# EAGLE schematic io-board-c-2 (EAGLE 8.4.3)
AUTHOR: Balazs Racz; DOCUMENT_NUMBER: none; DRAWING_TITLE: OpenLCB IO Board for Nucleo; LICENSE: [placeholder for license]; REVISION: A; YEAR: 2018
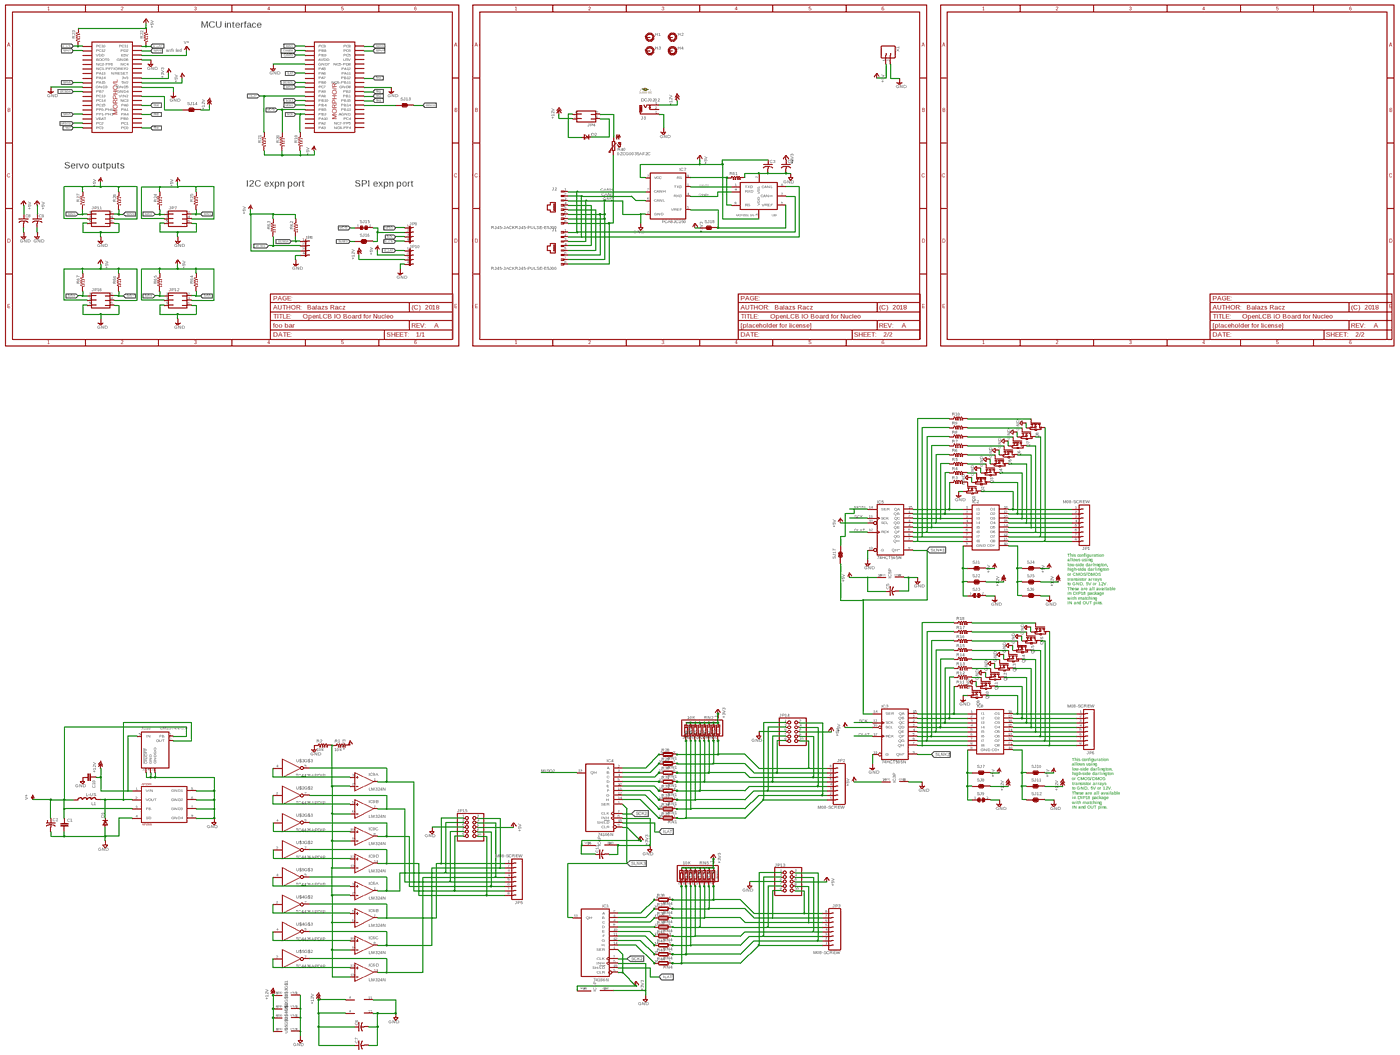
[diagram p0: schematic, sheet 1, overview]
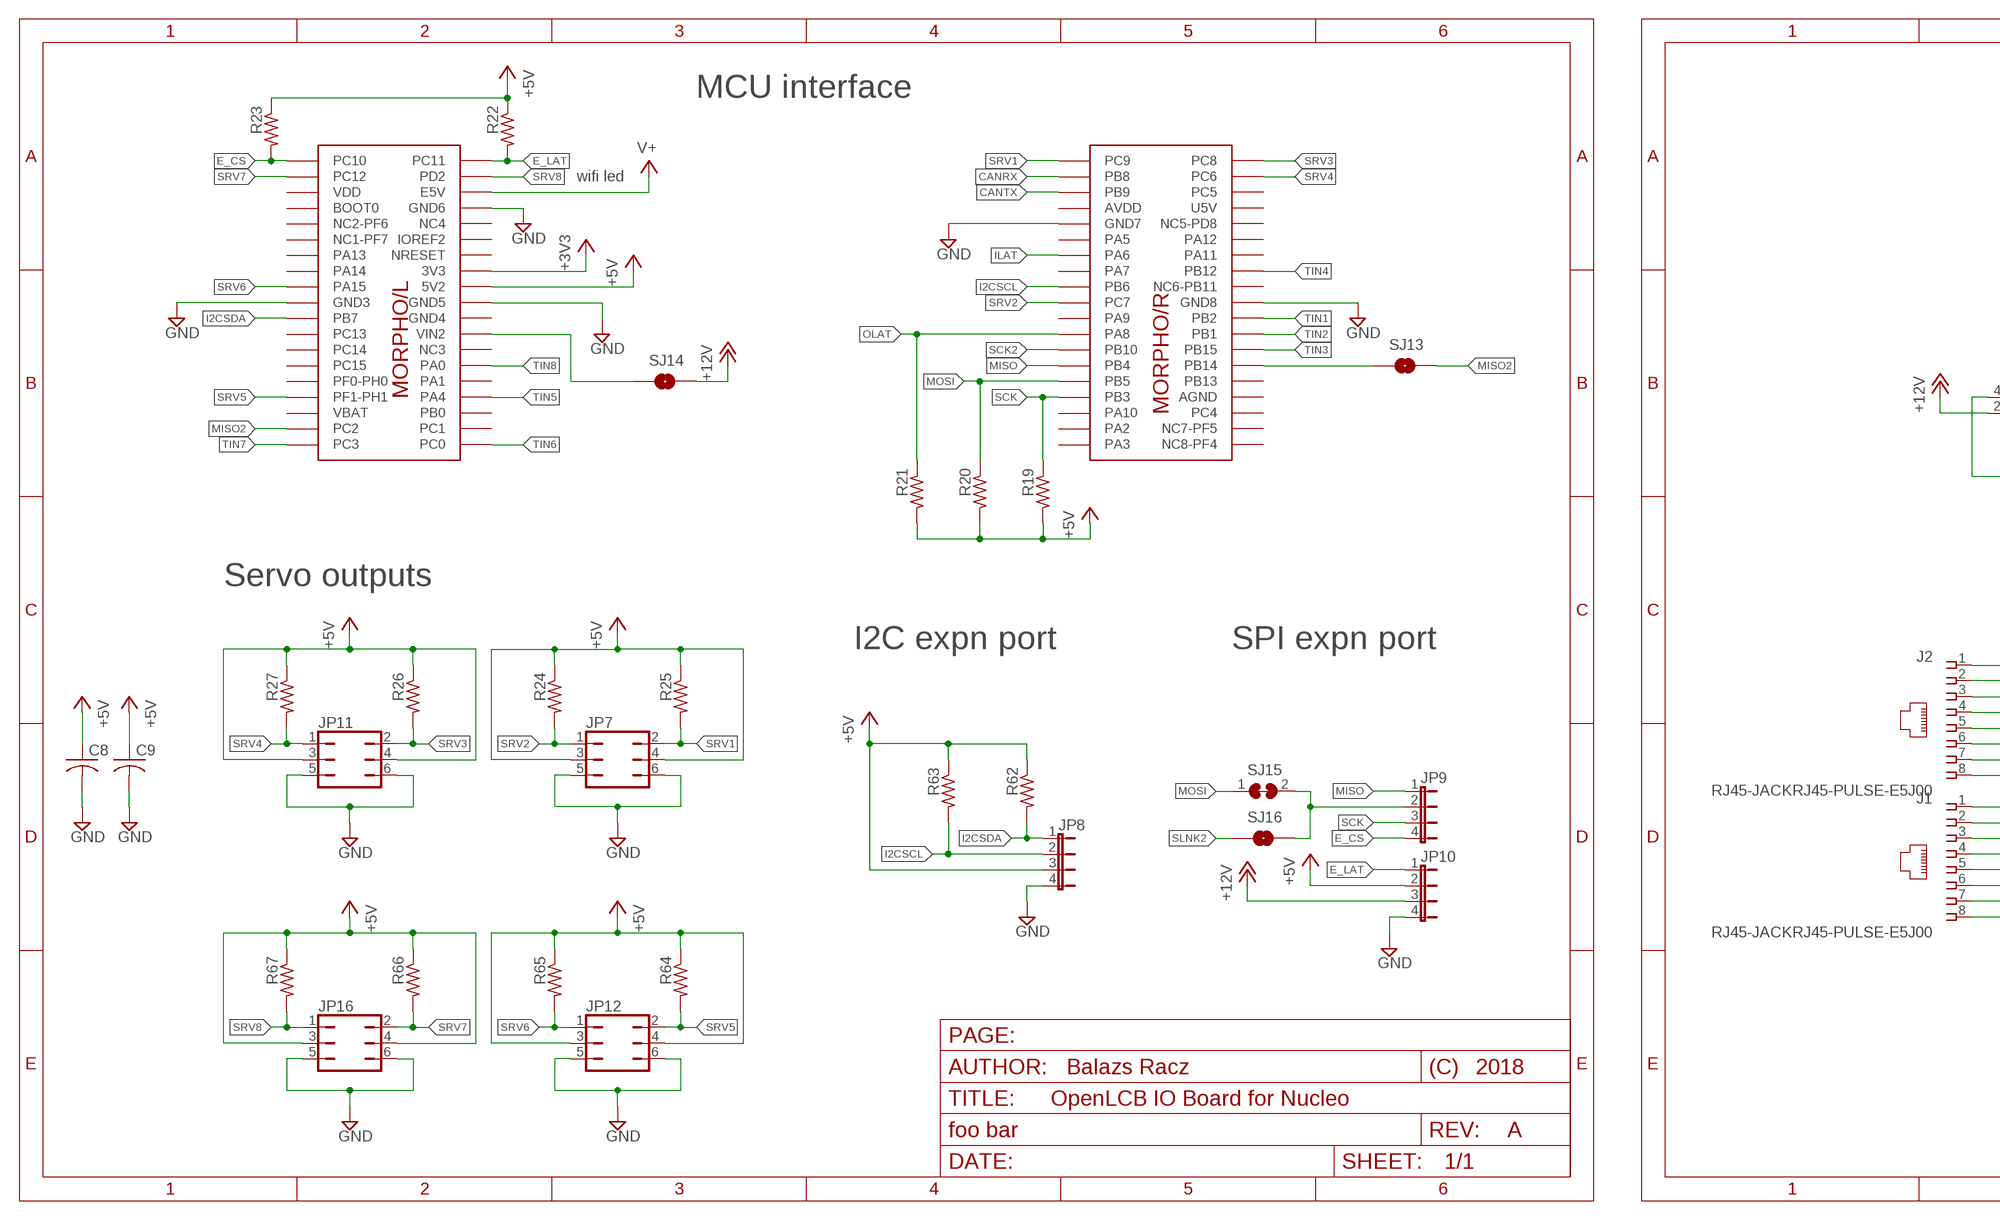
[diagram p1: schematic, sheet 1, part 1 of 4]
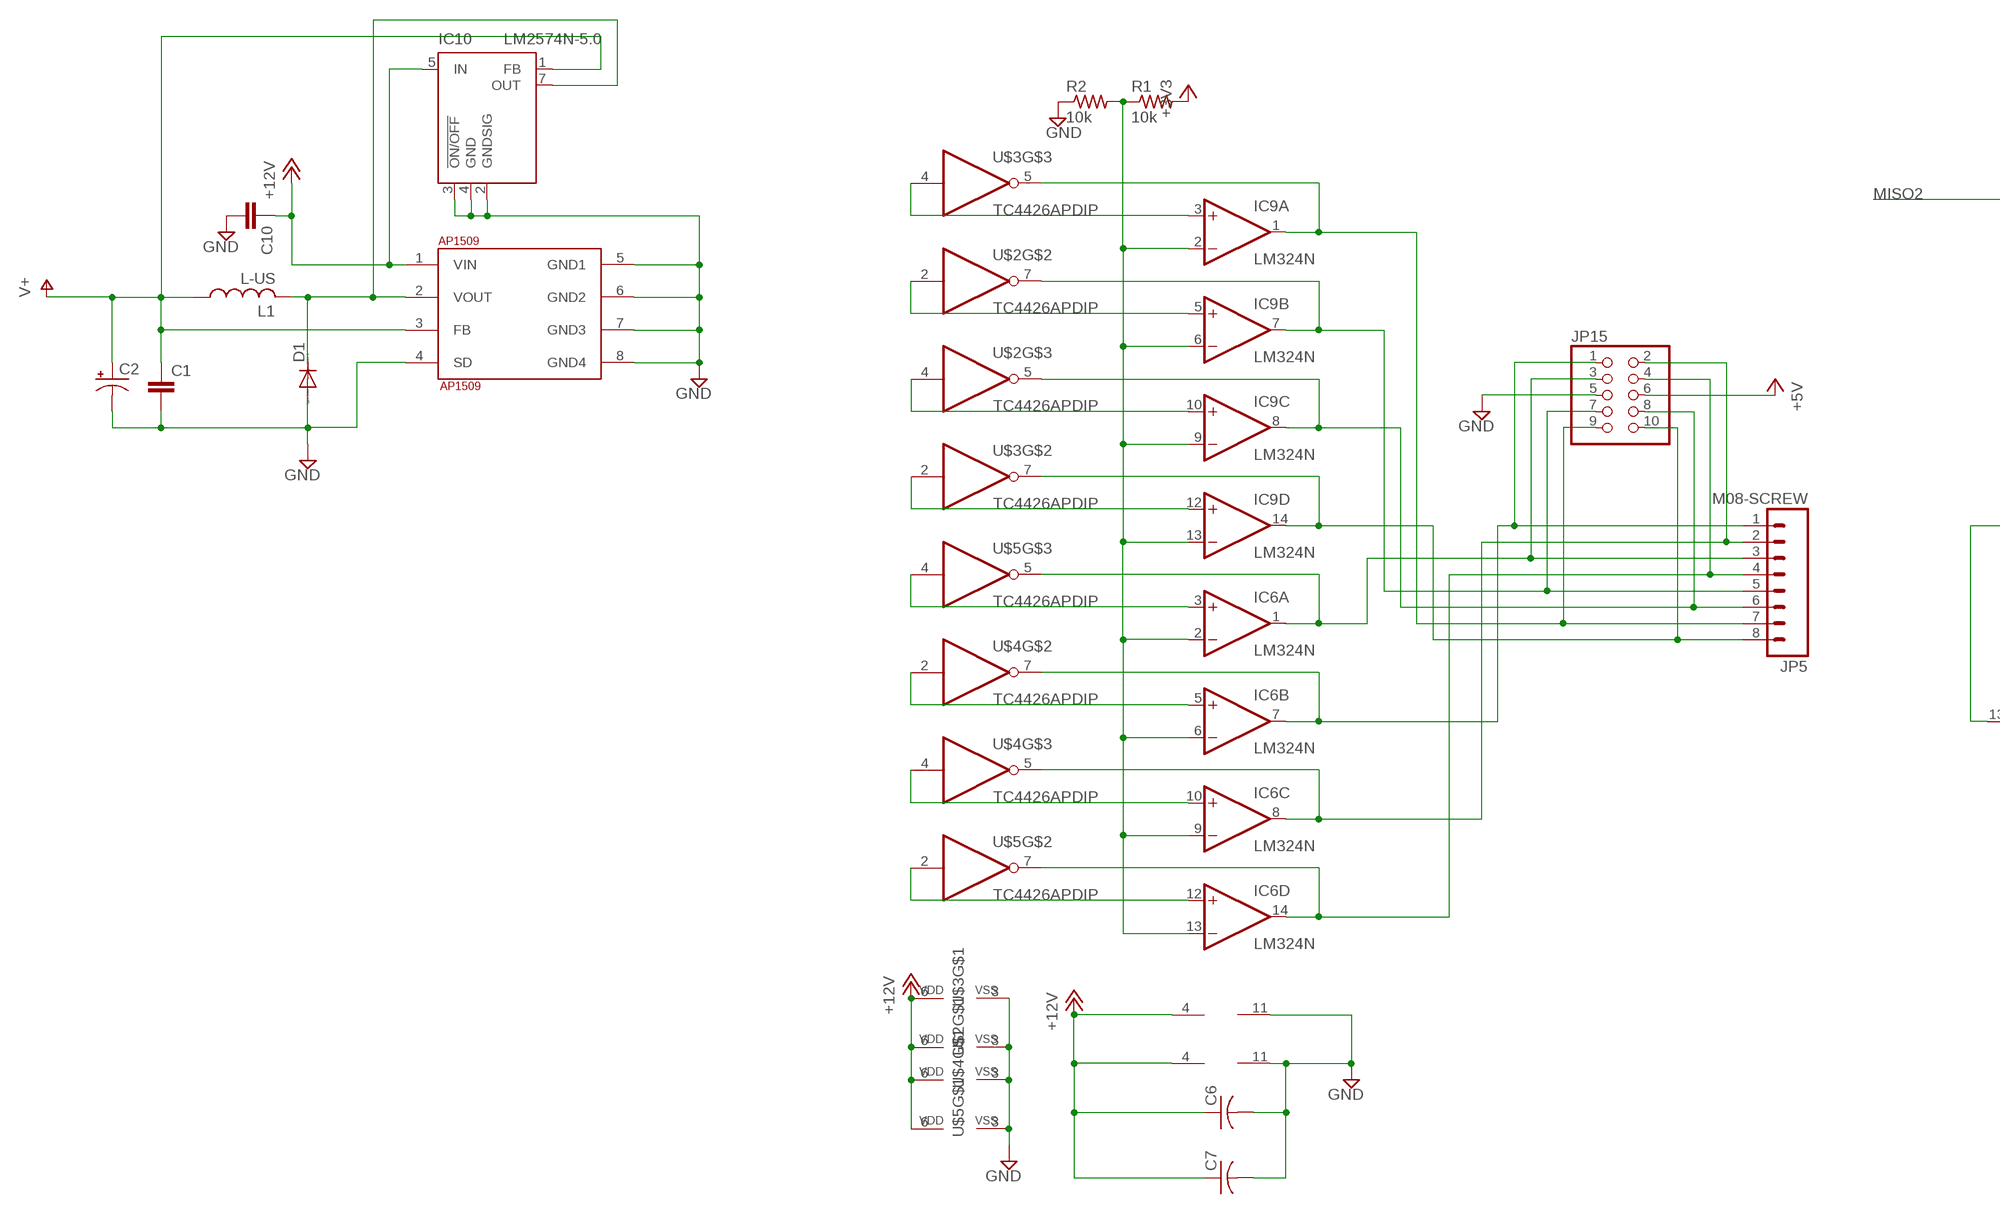
[diagram p2: schematic, sheet 1, part 2 of 4]
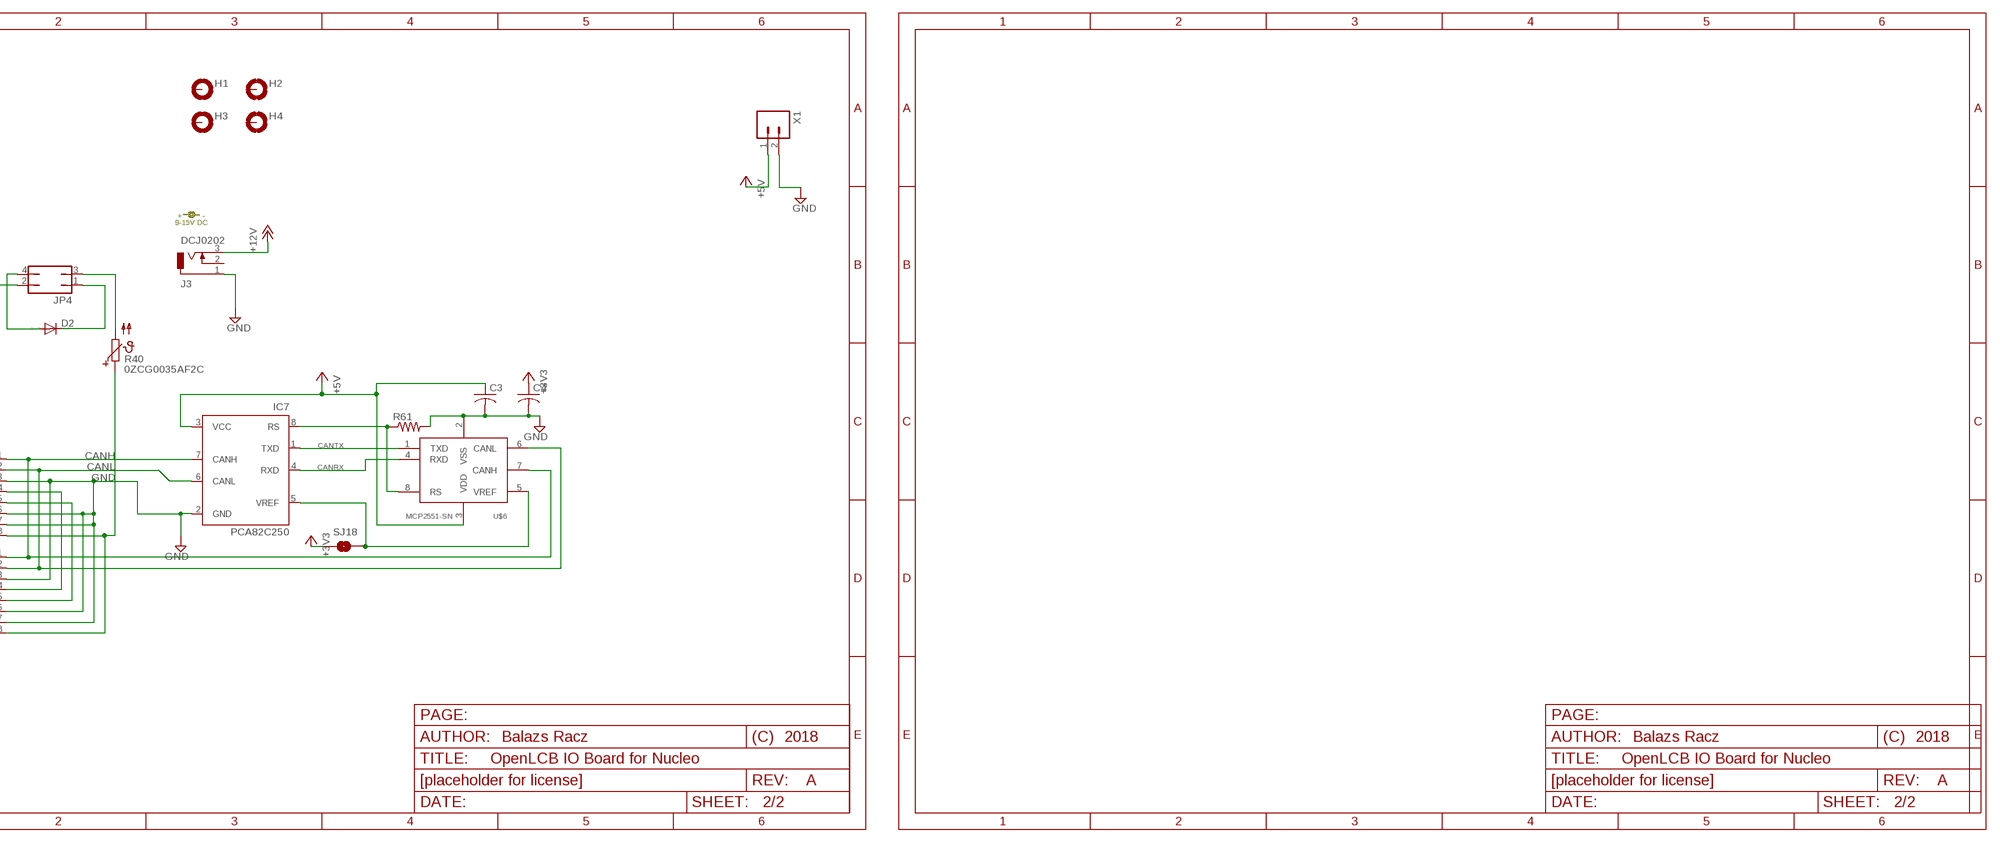
[diagram p3: schematic, sheet 1, part 3 of 4]
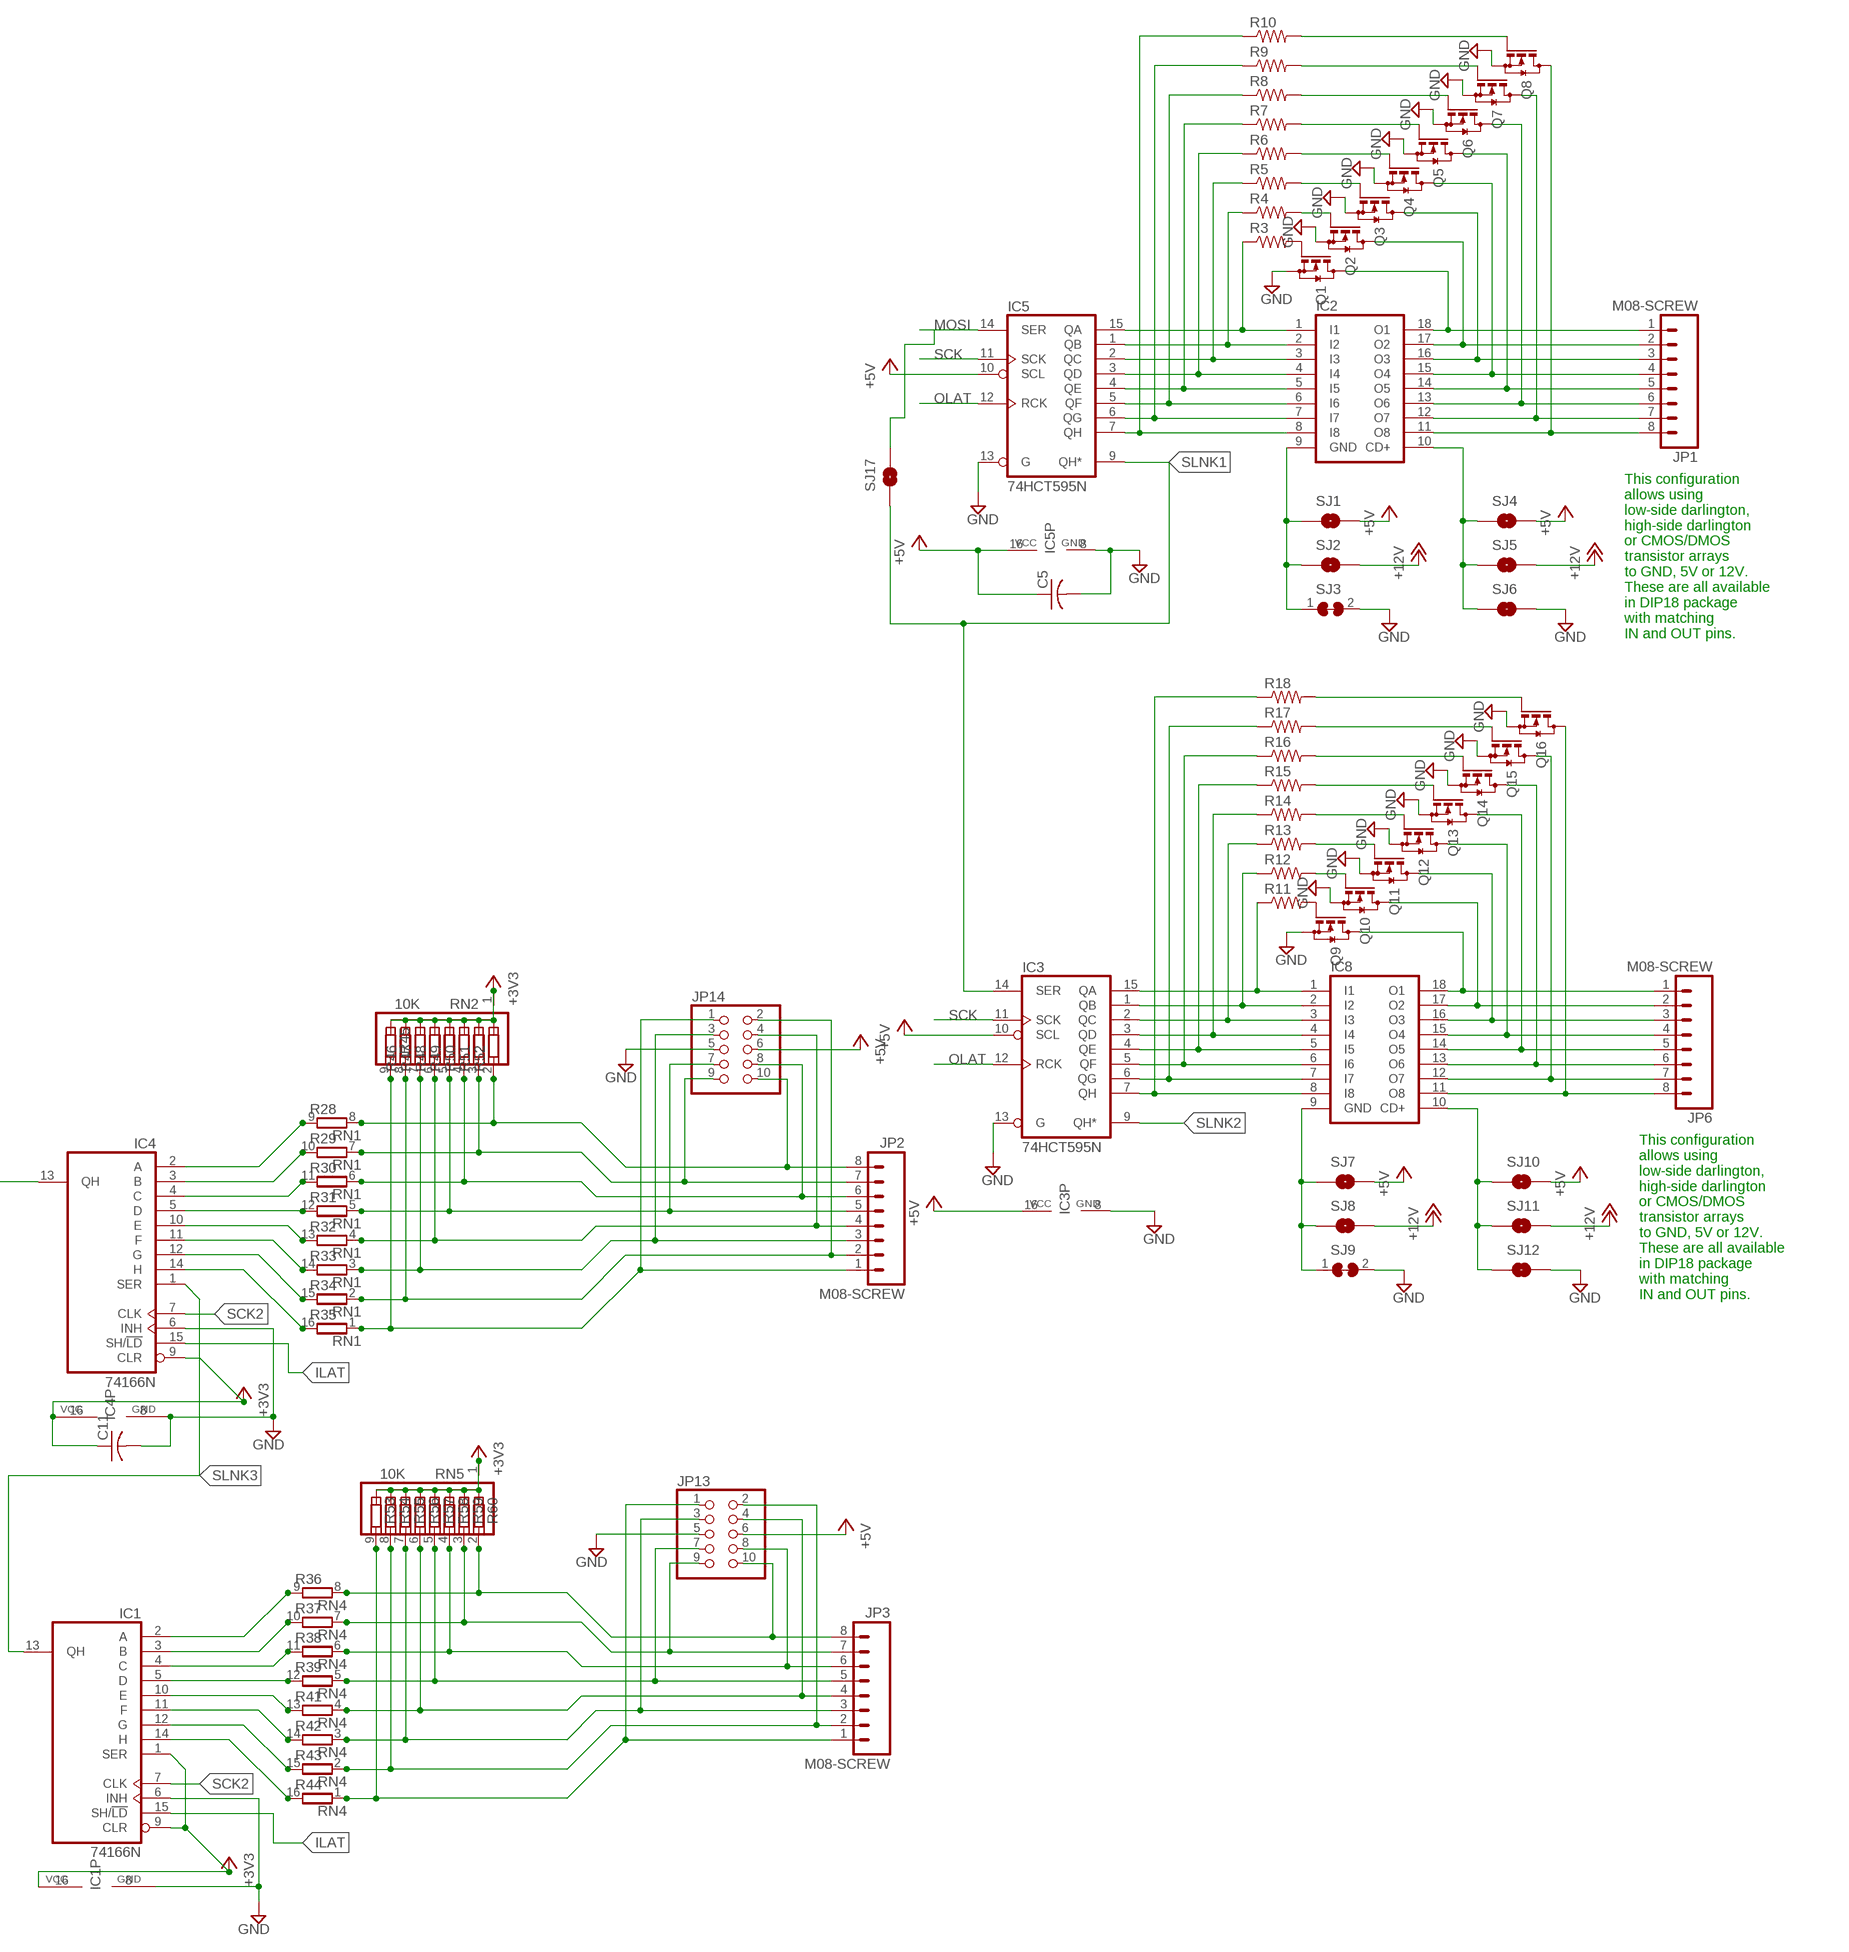
[diagram p4: schematic, sheet 1, part 4 of 4]
FRAME1 (FRAME_A_L): LICENSE: foo bar; PAGE: MCU interface, servo outputs, expansion port
FRAME2 (FRAME_A_L): PAGE: CAN-bus, power

## Parts
+12V  9-15V DC  DOC-POWER_LABEL  [POWER_USAGE]
AP1509  AP1509  [SO-08]
C1  C-EUC1206  [C1206]
C2  CPOL-USE2.5-5  [E2,5-5]
C3  C-USC0805  [C0805]
C4  C-USC0805  [C0805]
C5  C-USC0805  [C0805]
C6  C-USC1206  [C1206]
C7  C-USC1206  [C1206]
C8  C-USC1206  [C1206]
C9  C-USC1206  [C1206]
C10  C-EUC1206  [C1206]
C11  C-USC0805  [C0805]
D1  DIODE-DO41-7.6  [DO41-7.6]
D2  DIODE-DO41-7.6  [DO41-7.6]
H1  MOUNT-PAD-ROUND3.3  [3,3-PAD]
H2  MOUNT-PAD-ROUND3.3  [3,3-PAD]
H3  MOUNT-PAD-ROUND3.3  [3,3-PAD]
H4  MOUNT-PAD-ROUND3.3  [3,3-PAD]
IC1  74166N  [DIL16]
IC2  ULN2803A  [DIL18-THIN]
IC3  74HCT595N  [DIL16]
IC4  74166N  [DIL16]
IC5  74HCT595N  [DIL16]
IC6  LM324N  [DIL14]
IC7  PCA82C250  [DIL08]
IC8  ULN2803A  [DIL18-THIN]
IC9  LM324N  [DIL14]
IC10  LM2574N-5.0  [DIL08]
J1  RJ45-JACKRJ45-PULSE-E5J00  [RJ45-PULSE-E5J88]
J2  RJ45-JACKRJ45-PULSE-E5J00  [RJ45-PULSE-E5J88]
J3  DCJ0202  [DCJ0202]
JP1  M08-SCREW  [1X08_TERMINAL]
JP2  M08-SCREW  [1X08_TERMINAL]
JP3  M08-SCREW  [1X08_TERMINAL]
JP4  JP2Q  [JP2Q]
JP5  M08-SCREW  [1X08_TERMINAL]
JP6  M08-SCREW  [1X08_TERMINAL]
JP7  JP3Q  [JP3Q]
JP8  JP4-FLAT  [JP4F]
JP9  JP4-FLAT  [JP4F]
JP10  JP4-FLAT  [JP4F]
JP11  JP3Q  [JP3Q]
JP12  JP3Q  [JP3Q]
JP13  PINHD-2X5CN  [CON10M]
JP14  PINHD-2X5CN  [CON10M]
JP15  PINHD-2X5CN  [CON10M]
JP16  JP3Q  [JP3Q]
L1  L-US  [L5-8,5]
Q1  BSS123  [SOT23]
Q2  BSS123  [SOT23]
Q3  BSS123  [SOT23]
Q4  BSS123  [SOT23]
Q5  BSS123  [SOT23]
Q6  BSS123  [SOT23]
Q7  BSS123  [SOT23]
Q8  BSS123  [SOT23]
Q9  BSS123  [SOT23]
Q10  BSS123  [SOT23]
Q11  BSS123  [SOT23]
Q12  BSS123  [SOT23]
Q13  BSS123  [SOT23]
Q14  BSS123  [SOT23]
Q15  BSS123  [SOT23]
Q16  BSS123  [SOT23]
R1  10k  R-US_R0805  [R0805]
R2  10k  R-US_R0805  [R0805]
R3  R-US_R0603  [R0603]
R4  R-US_R0603  [R0603]
R5  R-US_R0603  [R0603]
R6  R-US_R0603  [R0603]
R7  R-US_R0603  [R0603]
R8  R-US_R0603  [R0603]
R9  R-US_R0603  [R0603]
R10  R-US_R0603  [R0603]
R11  R-US_R0603  [R0603]
R12  R-US_R0603  [R0603]
R13  R-US_R0603  [R0603]
R14  R-US_R0603  [R0603]
R15  R-US_R0603  [R0603]
R16  R-US_R0603  [R0603]
R17  R-US_R0603  [R0603]
R18  R-US_R0603  [R0603]
R19  R-US_R0805  [R0805]
R20  R-US_R0805  [R0805]
R21  R-US_R0805  [R0805]
R22  R-US_R0805  [R0805]
R23  R-US_R0805  [R0805]
R24  R-US_R0805  [R0805]
R25  R-US_R0805  [R0805]
R26  R-US_R0805  [R0805]
R27  R-US_R0805  [R0805]
R28  R-EU_R0603  [R0603]
R29  R-EU_R0603  [R0603]
R30  R-EU_R0603  [R0603]
R31  R-EU_R0603  [R0603]
R32  R-EU_R0603  [R0603]
R33  R-EU_R0603  [R0603]
R34  R-EU_R0603  [R0603]
R35  R-EU_R0603  [R0603]
R36  R-EU_R0603  [R0603]
R37  R-EU_R0603  [R0603]
R38  R-EU_R0603  [R0603]
R39  R-EU_R0603  [R0603]
R40  0ZCG0035AF2C  PTC_1812  [PTC1812]
R41  R-EU_R0603  [R0603]
R42  R-EU_R0603  [R0603]
R43  R-EU_R0603  [R0603]
R44  R-EU_R0603  [R0603]
R45  R-EU_R0603  [R0603]
R46  R-EU_R0603  [R0603]
R47  R-EU_R0603  [R0603]
R48  R-EU_R0603  [R0603]
R49  R-EU_R0603  [R0603]
R50  R-EU_R0603  [R0603]
R51  R-EU_R0603  [R0603]
R52  R-EU_R0603  [R0603]
R53  R-EU_R0603  [R0603]
R54  R-EU_R0603  [R0603]
R55  R-EU_R0603  [R0603]
R56  R-EU_R0603  [R0603]
R57  R-EU_R0603  [R0603]
R58  R-EU_R0603  [R0603]
R59  R-EU_R0603  [R0603]
R60  R-EU_R0603  [R0603]
R61  R-US_R0805  [R0805]
R62  R-US_R0805  [R0805]
R63  R-US_R0805  [R0805]
R64  R-US_R0805  [R0805]
R65  R-US_R0805  [R0805]
R66  R-US_R0805  [R0805]
R67  R-US_R0805  [R0805]
RN1  8R-P  [DIL16]
RN2  10K  G08R  [SIL9]
RN4  8R-P  [DIL16]
RN5  10K  G08R  [SIL9]
SJ1  SJRND2  [SJ_RND2]
SJ2  SJRND2  [SJ_RND2]
SJ3  SJ-C  [SJW-C]
SJ4  SJRND2  [SJ_RND2]
SJ5  SJRND2  [SJ_RND2]
SJ6  SJRND2  [SJ_RND2]
SJ7  SJRND2  [SJ_RND2]
SJ8  SJRND2  [SJ_RND2]
SJ9  SJ-C  [SJW-C]
SJ10  SJRND2  [SJ_RND2]
SJ11  SJRND2  [SJ_RND2]
SJ12  SJRND2  [SJ_RND2]
SJ13  SJRND2  [SJ_RND2]
SJ14  SJRND2  [SJ_RND2]
SJ15  SJ-C  [SJW-C]
SJ16  SJRND2  [SJ_RND2]
SJ17  SJRND2  [SJ_RND2]
SJ18  SJRND2  [SJ_RND2]
U$1  NUCLEO_64_GENERIC  [NUCLEO_BRD_BASE64]
U$2  TC4426APDIP  [DIL08-LONG]
U$3  TC4426APDIP  [DIL08-LONG]
U$4  TC4426APDIP  [DIL08-LONG]
U$5  TC4426APDIP  [DIL08-LONG]
U$6  MCP2551-SN  [SO-08]
X1  CONNECTOR-M023.5MM-LOCK  [SCREWTERMINAL-3.5MM-2_LOCK]

## Nets
+3V3: C4.1 C11.1 IC1.1(SER) IC1.9(CLR) IC1.16(VCC) IC4.9(CLR) IC4.16(VCC) R1.2 R45.1 R46.2 R47.2 R48.2 R49.2 R50.2 R51.2 R52.2 R53.1 R54.1 R55.1 R56.1 R57.1 R58.1 R59.1 R60.1 RN2.1 RN5.1 SJ18.P$1 U$1.3V3
+5V: C3.1 C5.1 C8.1 C9.1 IC3.10(SCL) IC3.16(VCC) IC5.10(SCL) IC5.16(VCC) IC7.3(VCC) JP7.3 JP7.4 JP8.3 JP10.2 JP11.3 JP11.4 JP12.3 JP12.4 JP13.6 JP14.6 JP15.6 JP16.3 JP16.4 R19.2 R20.2 R21.2 R22.1 R23.1 R24.1 R25.1 R26.1 R27.1 R62.1 R63.1 R64.1 R65.1 R66.1 R67.1 SJ1.P$2 SJ4.P$2 SJ7.P$2 SJ10.P$2 U$1.5V2 U$6.3(VDD) X1.1
+12V: AP1509.1(VIN) C6.1 C7.1 C10.1 IC6.4(P:V+) IC9.4(P:V+) IC10.5(IN) J3.3 JP4.2 JP10.3 SJ2.P$2 SJ5.P$2 SJ8.P$2 SJ11.P$2 SJ14.P$2 U$2.6(VDD) U$3.6(VDD) U$4.6(VDD) U$5.6(VDD)
CAN_RS: IC7.8(RS) R61.1 U$6.8(RS)
CAN_VIO: IC7.5(VREF) SJ18.P$2 U$6.5(VREF)
CANH: IC7.7(CANH) J1.1 J2.1 U$6.7(CANH)
CANL: IC7.6(CANL) J1.2 J2.2 U$6.6(CANL)
CANRX: IC7.4(RXD) U$1.PB8 U$6.4(RXD)
CANTX: IC7.1(TXD) U$1.PB9 U$6.1(TXD)
CMPREF: IC6.2(A:-IN) IC6.6(B:-IN) IC6.9(C:-IN) IC6.13(D:-IN) IC9.2(A:-IN) IC9.6(B:-IN) IC9.9(C:-IN) IC9.13(D:-IN) R1.1 R2.2
E_CS: JP9.4 R23.2 U$1.PC10
E_LAT: JP10.1 R22.2 U$1.PC11
E_MOSI: JP9.2 SJ15.2 SJ16.P$2
GND: AP1509.4(SD) AP1509.5(GND1) AP1509.6(GND2) AP1509.7(GND3) AP1509.8(GND4) C1.2 C2.- C3.2 C4.2 C5.2 C6.2 C7.2 C8.2 C9.2 C10.2 C11.2 D1.A IC1.6(INH) IC1.8(GND) IC3.8(GND) IC3.13(G) IC4.6(INH) IC4.8(GND) IC5.8(GND) IC5.13(G) IC6.11(P:V-) IC7.2(GND) IC9.11(P:V-) IC10.2(GNDSIG) IC10.3(!ON/OFF) IC10.4(GND) J1.3 J1.6 J1.7 J2.3 J2.6 J2.7 J3.1 JP7.5 JP7.6 JP8.4 JP10.4 JP11.5 JP11.6 JP12.5 JP12.6 JP13.5 JP14.5 JP15.5 JP16.5 JP16.6 Q1.2(S) Q2.2(S) Q3.2(S) Q4.2(S) Q5.2(S) Q6.2(S) Q7.2(S) Q8.2(S) Q9.2(S) Q10.2(S) Q11.2(S) Q12.2(S) Q13.2(S) Q14.2(S) Q15.2(S) Q16.2(S) R2.1 R61.2 SJ3.2 SJ6.P$2 SJ9.2 SJ12.P$2 U$1.GND3 U$1.GND5 U$1.GND6 U$1.GND7 U$1.GND8 U$2.3(VSS) U$3.3(VSS) U$4.3(VSS) U$5.3(VSS) U$6.2(VSS) X1.2
I2CSCL: JP8.2 R63.2 U$1.PB6
I2CSDA: JP8.1 R62.2 U$1.PB7
ILAT: IC1.15(SH/!LD) IC4.15(SH/!LD) U$1.PA6
LPOWA: IC8.9(GND) SJ7.P$1 SJ8.P$1 SJ9.1
LPOWB: IC8.10(CD+) SJ10.P$1 SJ11.P$1 SJ12.P$1
MISO: JP9.1 U$1.PB4
MISO2: IC4.13(QH) SJ13.P$2 U$1.PC2
MISO2_ALT: SJ13.P$1 U$1.PB14
MOSI: IC5.14(SER) R20.1 SJ15.1 SJ17.P$2 U$1.PB5
N$1: IC2.1(I1) IC5.15(QA) R3.1
N$2: IC2.18(O1) JP1.1 Q1.3(D)
N$3: IC2.2(I2) IC5.1(QB) R4.1
N$4: J1.4 J2.4
N$5: J1.5 J2.5
N$6: JP3.8 JP13.10 R36.2 R60.2 RN4.8 RN5.2
N$7: IC2.17(O2) JP1.2 Q2.3(D)
N$8: IC2.3(I3) IC5.2(QC) R5.1
N$9: IC2.16(O3) JP1.3 Q3.3(D)
N$10: IC2.4(I4) IC5.3(QD) R6.1
N$11: IC2.15(O4) JP1.4 Q4.3(D)
N$12: IC2.5(I5) IC5.4(QE) R7.1
N$13: IC2.14(O5) JP1.5 Q5.3(D)
N$14: JP3.7 JP13.9 R37.2 R59.2 RN4.7 RN5.3
N$15: JP3.6 JP13.8 R38.2 R58.2 RN4.6 RN5.4
N$16: Q4.1(G) R6.2
N$17: IC2.6(I6) IC5.5(QF) R8.1
N$18: IC2.13(O6) JP1.6 Q6.3(D)
N$19: JP3.4 JP13.4 R41.2 R56.2 RN4.4 RN5.6
N$20: JP3.3 JP13.3 R42.2 R55.2 RN4.3 RN5.7
N$21: JP2.6 JP14.8 R30.2 R50.1 RN1.6 RN2.4
N$22: JP3.1 JP13.1 R44.2 R53.2 RN4.1 RN5.9
N$23: IC1.2(A) R36.1 RN4.9
N$24: IC1.3(B) R37.1 RN4.10
N$25: JP2.8 JP14.10 R28.2 R52.1 RN1.8 RN2.2
N$26: JP2.7 JP14.9 R29.2 R51.1 RN1.7 RN2.3
N$27: Q5.1(G) R7.2
N$28: JP2.5 JP14.7 R31.2 R49.1 RN1.5 RN2.5
N$29: IC1.4(C) R38.1 RN4.11
N$30: IC1.5(D) R39.1 RN4.12
N$31: IC1.10(E) R41.1 RN4.13
N$32: IC1.11(F) R42.1 RN4.14
N$33: JP2.4 JP14.4 R32.2 R48.1 RN1.4 RN2.6
N$34: JP2.3 JP14.3 R33.2 R47.1 RN1.3 RN2.7
N$35: JP2.2 JP14.2 R34.2 R46.1 RN1.2 RN2.8
N$36: JP2.1 JP14.1 R35.2 R45.2 RN1.1 RN2.9
N$37: IC1.12(G) R43.1 RN4.15
N$38: IC1.14(H) R44.1 RN4.16
N$39: IC2.7(I7) IC5.6(QG) R9.1
N$40: IC2.12(O7) JP1.7 Q7.3(D)
N$41: IC2.8(I8) IC5.7(QH) R10.1
N$42: IC2.11(O8) JP1.8 Q8.3(D)
N$43: Q6.1(G) R8.2
N$44: IC4.2(A) R28.1 RN1.9
N$45: D2.C JP4.1
N$46: D2.A JP4.4
N$47: IC4.3(B) R29.1 RN1.10
N$48: IC4.4(C) R30.1 RN1.11
N$49: IC4.5(D) R31.1 RN1.12
N$50: IC4.10(E) R32.1 RN1.13
N$51: IC4.11(F) R33.1 RN1.14
N$52: IC4.12(G) R34.1 RN1.15
N$53: IC4.14(H) R35.1 RN1.16
N$56: IC3.15(QA) IC8.1(I1) R11.1
N$57: JP4.3 R40.2
N$60: SJ14.P$1 U$1.VIN2
N$65: Q7.1(G) R9.2
N$75: IC8.11(O8) JP6.8 Q16.3(D)
N$78: Q1.1(G) R3.2
N$79: Q2.1(G) R4.2
N$83: JP3.5 JP13.7 R39.2 R57.2 RN4.5 RN5.5
N$84: JP3.2 JP13.2 R43.2 R54.2 RN4.2 RN5.8
N$85: Q8.1(G) R10.2
N$87: IC8.18(O1) JP6.1 Q9.3(D)
N$88: Q3.1(G) R5.2
N$89: IC3.1(QB) IC8.2(I2) R12.1
N$91: IC8.17(O2) JP6.2 Q10.3(D)
N$92: IC3.2(QC) IC8.3(I3) R13.1
N$93: IC8.16(O3) JP6.3 Q11.3(D)
N$94: IC3.3(QD) IC8.4(I4) R14.1
N$95: IC8.15(O4) JP6.4 Q12.3(D)
N$96: IC3.4(QE) IC8.5(I5) R15.1
N$97: IC8.14(O5) JP6.5 Q13.3(D)
N$98: IC3.5(QF) IC8.6(I6) R16.1
N$99: IC8.13(O6) JP6.6 Q14.3(D)
N$100: IC3.6(QG) IC8.7(I7) R17.1
N$101: IC8.12(O7) JP6.7 Q15.3(D)
N$102: IC3.7(QH) IC8.8(I8) R18.1
N$104: Q9.1(G) R11.2
N$105: Q10.1(G) R12.2
N$106: Q11.1(G) R13.2
N$107: Q12.1(G) R14.2
N$108: Q13.1(G) R15.2
N$109: Q14.1(G) R16.2
N$110: Q15.1(G) R17.2
N$111: Q16.1(G) R18.2
OLAT: IC3.12(RCK) IC5.12(RCK) R21.1 U$1.PA8
PWR_POS: J1.8 J2.8 R40.1
RPOWA: IC2.9(GND) SJ1.P$1 SJ2.P$1 SJ3.1
RPOWB: IC2.10(CD+) SJ4.P$1 SJ5.P$1 SJ6.P$1
SCK: IC3.11(SCK) IC5.11(SCK) JP9.3 R19.1 U$1.PB3
SCK2: IC1.7(CLK) IC4.7(CLK) U$1.PB10
SLNK1: IC3.14(SER) IC5.9(QH*) SJ17.P$1
SLNK2: IC3.9(QH*) SJ16.P$1
SLNK3: IC1.13(QH) IC4.1(SER)
SRV1: JP7.2 R25.2 U$1.PC9
SRV2: JP7.1 R24.2 U$1.PC7
SRV3: JP11.2 R26.2 U$1.PC8
SRV4: JP11.1 R27.2 U$1.PC6
SRV5: JP12.2 R64.2 U$1.PF1-PH1
SRV6: JP12.1 R65.2 U$1.PA15
SRV7: JP16.2 R66.2 U$1.PC12
SRV8: JP16.1 R67.2 U$1.PD2
SW: AP1509.2(VOUT) D1.C IC10.7(OUT) L1.2
TIN1: IC9.3(A:+IN) U$1.PB2 U$3.4(I)
TIN2: IC9.5(B:+IN) U$1.PB1 U$2.2(I)
TIN3: IC9.10(C:+IN) U$1.PB15 U$2.4(I)
TIN4: IC9.12(D:+IN) U$1.PB12 U$3.2(I)
TIN5: IC6.3(A:+IN) U$1.PA4 U$5.4(I)
TIN6: IC6.5(B:+IN) U$1.PC0 U$4.2(I)
TIN7: IC6.10(C:+IN) U$1.PC3 U$4.4(I)
TIN8: IC6.12(D:+IN) U$1.PA0 U$5.2(I)
TOUT1: IC6.7(B:OUT) JP5.1 JP15.1 U$4.7(O)
TOUT2: IC6.8(C:OUT) JP5.2 JP15.2 U$4.5(O)
TOUT3: IC6.1(A:OUT) JP5.3 JP15.3 U$5.5(O)
TOUT4: IC6.14(D:OUT) JP5.4 JP15.4 U$5.7(O)
TOUT5: IC9.7(B:OUT) JP5.5 JP15.7 U$2.7(O)
TOUT6: IC9.8(C:OUT) JP5.6 JP15.8 U$2.5(O)
TOUT7: IC9.1(A:OUT) JP5.7 JP15.9 U$3.5(O)
TOUT8: IC9.14(D:OUT) JP5.8 JP15.10 U$3.7(O)
V+: AP1509.3(FB) C1.1 C2.+ IC10.1(FB) L1.1 U$1.E5V
Unconnected: H1.B3,3(MOUNT) H2.B3,3(MOUNT) H3.B3,3(MOUNT) H4.B3,3(MOUNT) J3.2 U$1.BOOT0 U$1.IOREF2 U$1.NC1-PF7 U$1.NC2-PF6 U$1.NC3 U$1.NC4 U$1.NC5-PD8 U$1.NC6-PB11 U$1.NC7-PF5 U$1.NC8-PF4 U$1.NRESET U$1.PA1 U$1.PA2 U$1.PA3 U$1.PA5 U$1.PA7 U$1.PA9 U$1.PA10 U$1.PA11 U$1.PA12 U$1.PA13 U$1.PA14 U$1.PB0 U$1.PB13 U$1.PC1 U$1.PC4 U$1.PC5 U$1.PC13 U$1.PC14 U$1.PC15 U$1.PF0-PH0

## Notes on the sheet
- MCU interface
- wifi led
- Servo outputs
- I2C expn port | SPI expn port
- This configuration
  allows using
  low-side darlington,
  high-side darlington
  or CMOS/DMOS 
  transistor arrays 
  to GND, 5V or 12V. 
  These are all available 
  in DIP18 package 
  with matching 
  IN and OUT pins.
- This configuration
  allows using
  low-side darlington,
  high-side darlington
  or CMOS/DMOS 
  transistor arrays 
  to GND, 5V or 12V. 
  These are all available 
  in DIP18 package 
  with matching 
  IN and OUT pins.

## Power pins joined to a net without a drawn wire
AGND: U$1.AGND
AVDD: U$1.AVDD
GND4: U$1.GND4
U5V: U$1.U5V
VBAT: U$1.VBAT
VDD: U$1.VDD

## Library data of the parts
+12V = SPCoast:DOC-POWER_LABEL
AP1509 = trainlib:AP1509
C1 C10 = rcl:C-EU: CAPACITOR, European symbol
C2 = rcl:CPOL-US: POLARIZED CAPACITOR, American symbol
C3-C9 C11 = rcl:C-US: CAPACITOR, American symbol
D1 D2 = diode:DIODE-: DIODE
H1-H4 = holes:MOUNT-PAD-ROUND: MOUNTING PAD, round
IC1 IC4 = 74xx-us:74*166: 8-bit parallel load SHIFT REGISTER
IC2 IC8 = trainlib:ULN2803A: DRIVER ARRAY
IC3 IC5 = 74xx-eu:74*595: 8-bit SHIFT REGISTER, output latch
IC6 IC9 = linear:LM324: OP AMP
IC7 = trainlib:PCA82C250: CAN CONTROLLER INTERFACE; OC_FARNELL: 3692358; OC_NEWARK: unknown
IC10 = linear:LM2574?-*: SIMPLE SWITCHER 0.5A Step-Down Voltage Regulator Source: http://cache.national.com/ds/LM/LM2574.pdf
J1 J2 = trainlib:RJ45-JACK: Mod. Jack, Right Angle, 8 posiotion, 8 contatcs RJ45 Source: GLX-S-88M.pdf
J3 = con-jack:DCJ0202: DC POWER JACK Source: DCJ0202.pdf; OC_FARNELL: unknown; OC_NEWARK: unknown
JP1-JP3 JP5 JP6 = trainlib:M08-SCREW
JP4 = jumper:JP2Q: JUMPER
JP7 JP11 JP12 JP16 = jumper:JP3Q: JUMPER
JP8-JP10 = trainlib:JP4-FLAT: JUMPER
JP13-JP15 = trainlib:PINHD-2X5: PIN HEADER
L1 = trainlib:L-US
Q1-Q16 = transistor-small-signal:BSS123: N-CHANNEL MOS FET
R1-R27 R61-R67 = rcl:R-US_: RESISTOR, American symbol
R28-R39 R41-R60 = rcl:R-EU_: RESISTOR, European symbol
R40 = tcs:PTC_: PHILIPS PTC
RN1 RN4 = resistor-dil:8R-P: DIL RESISTOR; OC_FARNELL: unknown; OC_NEWARK: unknown
RN2 RN5 = resistor-sil:G08R: SIL RESISTOR; OC_FARNELL: unknown; OC_NEWARK: unknown
SJ1 SJ2 SJ4-SJ8 SJ10-SJ14 SJ16-SJ18 = trainlib:SJ: SMD solder JUMPER
SJ3 SJ9 SJ15 = trainlib:SJ-C
U$1 = trainlib:NUCLEO_64_GENERIC
U$2-U$5 = trainlib:TC4426A: The TC4426A (dual inverter), 4427A (dual buffer) and 4428A (buffer+inverter) are improved buffer/drivers. They will not latch up under any conditions within their power and voltage ratings. They are not subject to damage when up to 5V of noise spiking (of either polarity) occurs on the ground pin. They can accept, without damage or logic upset, up to 500 mA of reverse current (of either polarity) being forced back into their outputs. All terminals are fully protected against up to 4 kV of electrostatic discharge. As MOSFET drivers, the TC4426A/4427A/4428A can easily switch 1000 pF gate capacitances in under 30 ns, and provide low enough impedances in both the ON and OFF states to ensure the MOSFET's intended state will not be affected, even by large transients.
U$6 = SPCoast:MCP2551: MCP2551 High-Speed CAN Transceiver
X1 = SPCoast:CONNECTOR-M02: PHOENIX CONNECTOR